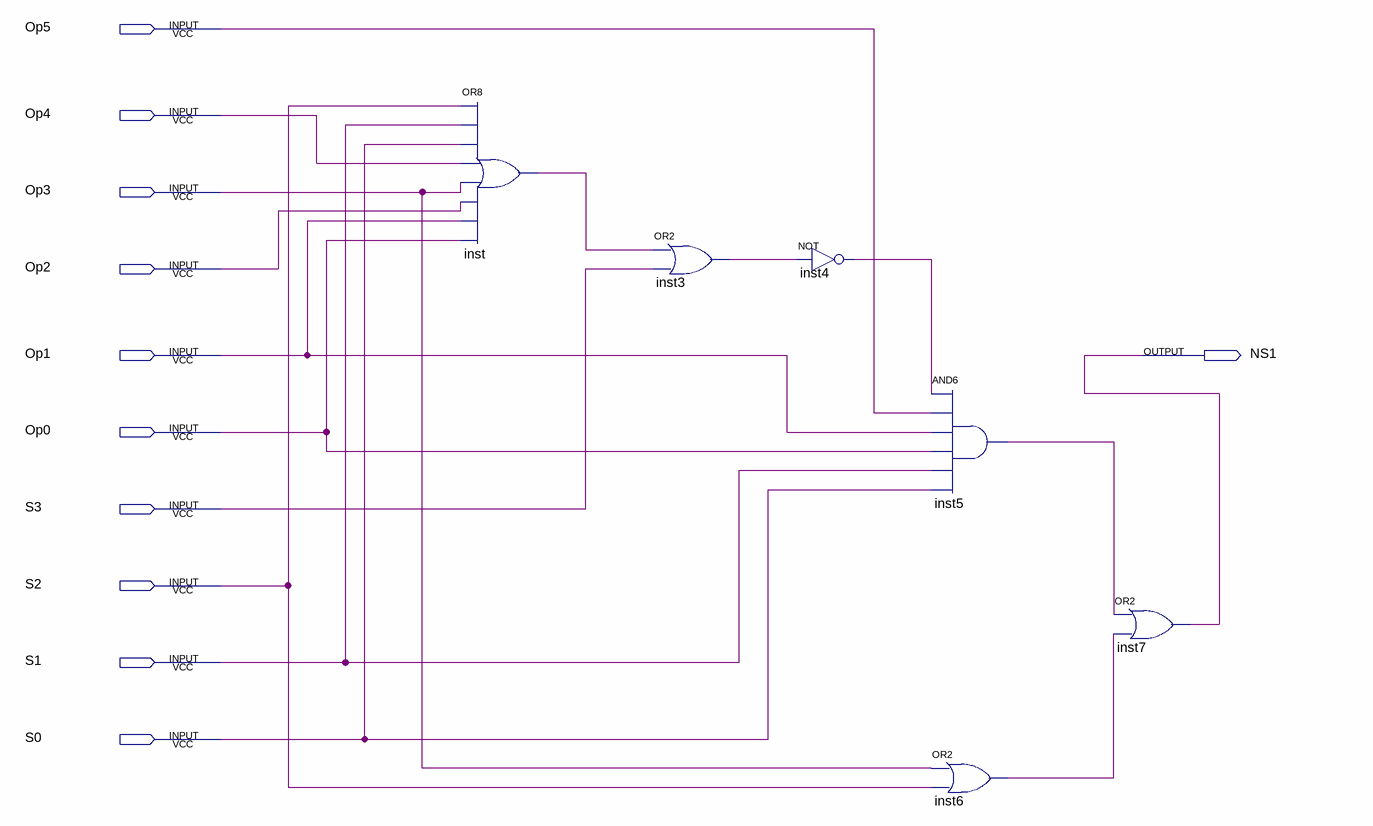
[diagram p0: schematic sheet]
// Quartus schematic NS1.bdf as structural Verilog: 6 symbols, 11 pins
module NS1 (
  input  Op5,
  input  Op4,
  input  Op3,
  input  Op2,
  input  Op1,
  input  Op0,
  input  S3,
  input  S2,
  input  S1,
  input  S0,
  output NS1
);

  wire inst3_out, inst4_out, inst5_out, inst6_out, inst_out;

  or inst (inst_out, S2, S1, S0, Op4, Op3, Op2, Op1, Op0);
  or inst3 (inst3_out, inst_out, S3);
  not inst4 (inst4_out, inst3_out);
  and inst5 (inst5_out, inst4_out, Op5, Op1, Op0, S1, S0);
  or inst6 (inst6_out, Op3, S2);
  or inst7 (NS1, inst5_out, inst6_out);
endmodule
